# EAGLE schematic deflectorshield_tng (EAGLE 7.6.0)
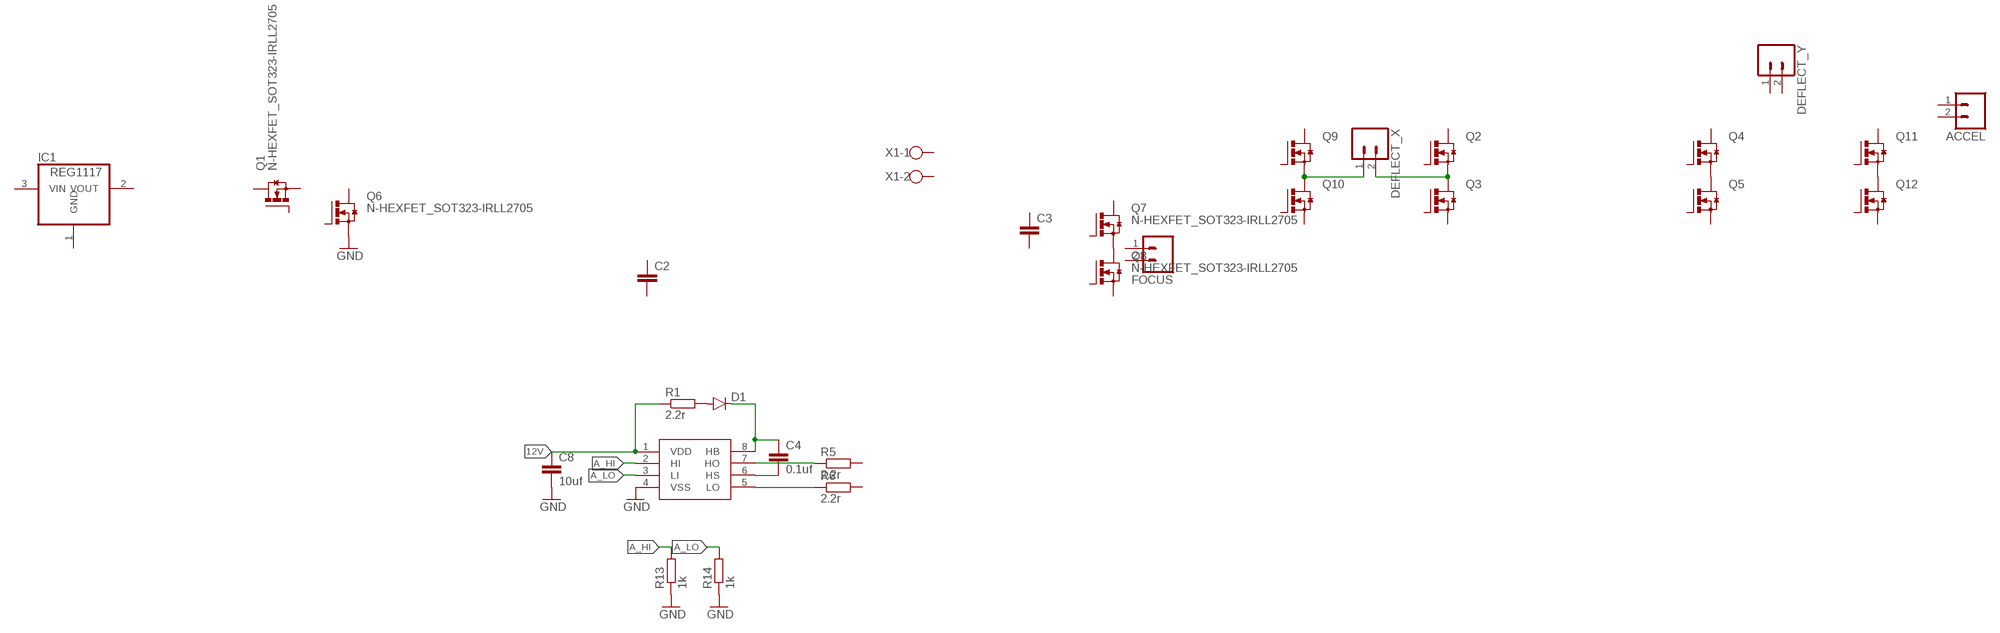
[diagram p0: schematic, sheet 1]

## Parts
ACCEL  M023.5MM  [SCREWTERMINAL-3.5MM-2]
C2  C-EUC0805  [C0805]
C3  C-EUC0805  [C0805]
C4  0.1uf  C-EUC0603  [C0603]
C8  10uf  C-EUC0805  [C0805]
D1  DIODESMA  [SMA-DIODE]
DEFLECT_X  M023.5MM  [SCREWTERMINAL-3.5MM-2]
DEFLECT_Y  M023.5MM  [SCREWTERMINAL-3.5MM-2]
FOCUS  M023.5MM  [SCREWTERMINAL-3.5MM-2]
IC1  REG1117  [SOT223]
Q1  N-HEXFET_SOT323-IRLL2705  [SOT223]
Q2  N-HEXFET_SOT323-IRLL2705  [SOT223]
Q3  N-HEXFET_SOT323-IRLL2705  [SOT223]
Q4  N-HEXFET_SOT323-IRLL2705  [SOT223]
Q5  N-HEXFET_SOT323-IRLL2705  [SOT223]
Q6  N-HEXFET_SOT323-IRLL2705  [SOT223]
Q7  N-HEXFET_SOT323-IRLL2705  [SOT223]
Q8  N-HEXFET_SOT323-IRLL2705  [SOT223]
Q9  N-HEXFET_SOT323-IRLL2705  [SOT223]
Q10  N-HEXFET_SOT323-IRLL2705  [SOT223]
Q11  N-HEXFET_SOT323-IRLL2705  [SOT223]
Q12  N-HEXFET_SOT323-IRLL2705  [SOT223]
R1  2.2r  R-EU_R1210  [R1210]
R5  2.2r  R-EU_R1210  [R1210]
R6  2.2r  R-EU_R1210  [R1210]
R13  1k  R-EU_R0603  [R0603]
R14  1k  R-EU_R0603  [R0603]
U$2  LM5109  [SOIC8]
X1  W237-102  [W237-102]

## Nets
12V: C8.1 R1.1 U$2.1(VDD)
A_HI: R13.2 U$2.2(HI)
A_LO: R14.2 U$2.3(LI)
GND: C8.2 Q6.3(S) R13.1 R14.1 U$2.4(VSS)
N$1: DEFLECT_X.2 Q2.3(S) Q3.4(D)
N$3: Q4.3(S) Q5.4(D)
N$4: Q11.3(S) Q12.4(D)
N$5: Q7.3(S) Q8.4(D)
N$6: D1.A R1.2
N$7: C4.1 D1.C U$2.8(HB)
N$8: C4.2 U$2.6(HS)
N$9: DEFLECT_X.1 Q9.3(S) Q10.4(D)
N$15: R5.1 U$2.7(HO)
N$16: R6.1 U$2.5(LO)
Unconnected: ACCEL.1 ACCEL.2 C2.1 C2.2 C3.1 C3.2 DEFLECT_Y.1 DEFLECT_Y.2 FOCUS.1 FOCUS.2 IC1.2(VOUT) IC1.3(VIN) Q1.1(G) Q1.3(S) Q1.4(D) Q2.1(G) Q2.4(D) Q3.1(G) Q3.3(S) Q4.1(G) Q4.4(D) Q5.1(G) Q5.3(S) Q6.1(G) Q6.4(D) Q7.1(G) Q7.4(D) Q8.1(G) Q8.3(S) Q9.1(G) Q9.4(D) Q10.1(G) Q10.3(S) Q11.1(G) Q11.4(D) Q12.1(G) Q12.3(S) R5.2 R6.2 X1.1 X1.2

## Power pins joined to a net without a drawn wire
GND: IC1.1(GND)

## Library data of the parts
ACCEL DEFLECT_X DEFLECT_Y FOCUS = SparkFun-Connectors:M02: Standard 2-pin 0.1" header. Use with - straight break away headers ( PRT-00116) - right angle break away headers (PRT-00553) - swiss pins (PRT-00743) - machine pins (PRT-00117) - female headers (PRT-00115) Molex polarized connector foot print use with: PRT-08233 with associated crimp pins and housings. 2.54_SCREWTERM for use with PRT-10571. 3.5mm Screw Terminal footprints for PRT-08084 5mm Screw Terminal footprints for use with PRT-08432; PROD_ID: CONN-08399
C2 C3 = resistor:C-EU: CAPACITOR, European symbol
C4 C8 = rcl:C-EU: CAPACITOR, European symbol
D1 = SparkFun-DiscreteSemi:DIODE: Diode These are standard reverse protection diodes and small signal diodes. SMA package can handle up to about 1A. SOD-323 can handle about 200mA. What the SOD-323 package when ordering, there are some mfgs out there that are 5-pin packages.
IC1 = burr-brown:REG1117: 800mA and 1A Low Dropout (LDO) Positive Regulator 1.8V, 2.5V, 2.85V, 3.3V, 5V, and Adj; MPN: REG1117; OC_FARNELL: 1097566; OC_NEWARK: 14P6981
Q1-Q12 = transistor-power:N-HEXFET_?-*: HEXFET® Power MOSFET
R1 R5 R6 R13 R14 = rcl:R-EU_: RESISTOR, European symbol
U$2 = TheLibrary:LM5109
X1 = con-wago-500:W237-102: WAGO SCREW CLAMP; MPN: 237-102; OC_FARNELL: unknown; OC_NEWARK: 70K9898

## Net classes
0 default: width 0.508 mm